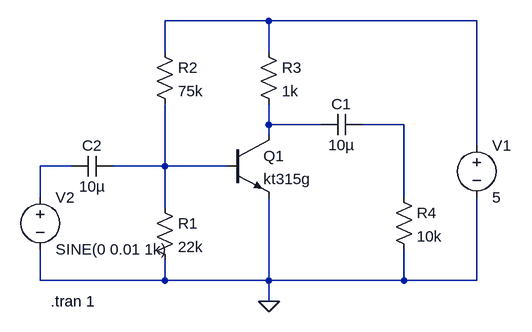
[diagram p0: schematic lab4.asc]
lab4.asc, the LTspice schematic file:
Version 4
SHEET 1 880 680
WIRE 160 -32 0 -32
WIRE 480 -32 160 -32
WIRE 0 16 0 -32
WIRE 160 16 160 -32
WIRE 160 128 160 96
WIRE 240 128 160 128
WIRE 368 128 304 128
WIRE 160 144 160 128
WIRE 480 160 480 -32
WIRE -144 192 -192 192
WIRE 0 192 0 96
WIRE 0 192 -80 192
WIRE 96 192 0 192
WIRE -192 240 -192 192
WIRE 368 240 368 128
WIRE 0 256 0 192
WIRE -192 368 -192 320
WIRE 0 368 0 336
WIRE 0 368 -192 368
WIRE 160 368 160 240
WIRE 160 368 0 368
WIRE 368 368 368 320
WIRE 368 368 160 368
WIRE 480 368 480 240
WIRE 480 368 368 368
WIRE 160 400 160 368
FLAG 160 400 0
SYMBOL npn 96 144 R0
SYMATTR InstName Q1
SYMATTR Value kt315g
SYMBOL res -16 240 R0
SYMATTR InstName R1
SYMATTR Value 22k
SYMBOL res -16 0 R0
SYMATTR InstName R2
SYMATTR Value 75k
SYMBOL res 144 0 R0
SYMATTR InstName R3
SYMATTR Value 1k
SYMBOL res 352 224 R0
SYMATTR InstName R4
SYMATTR Value 10k
SYMBOL cap 304 112 R90
WINDOW 0 0 32 VBottom 2
WINDOW 3 32 32 VTop 2
SYMATTR InstName C1
SYMATTR Value 10µ
SYMBOL cap -80 176 R90
WINDOW 0 0 32 VBottom 2
WINDOW 3 32 32 VTop 2
SYMATTR InstName C2
SYMATTR Value 10µ
SYMBOL voltage 480 144 R0
WINDOW 123 0 0 Left 2
WINDOW 39 0 0 Left 2
SYMATTR InstName V1
SYMATTR Value 5
SYMBOL voltage -192 224 R0
WINDOW 123 0 0 Left 2
WINDOW 39 0 0 Left 2
SYMATTR InstName V2
SYMATTR Value SINE(0 0.01 1k)
TEXT -176 400 Left 2 !.tran 1

The netlist it stands for:
* lab4.asc
Q1 N002 N005 0 0 kt315g
R1 N005 0 22k
R2 N001 N005 75k
R3 N001 N002 1k
R4 N003 0 10k
C1 N003 N002 10µ
C2 N005 N004 10µ
V1 N001 0 5
V2 N004 0 SINE(0 0.01 1k)
.model NPN NPN
.model PNP PNP
.lib standard.bjt
.tran 1
.backanno
.end